# EAGLE design Konwerter USB RS485 (EAGLE 5.09)
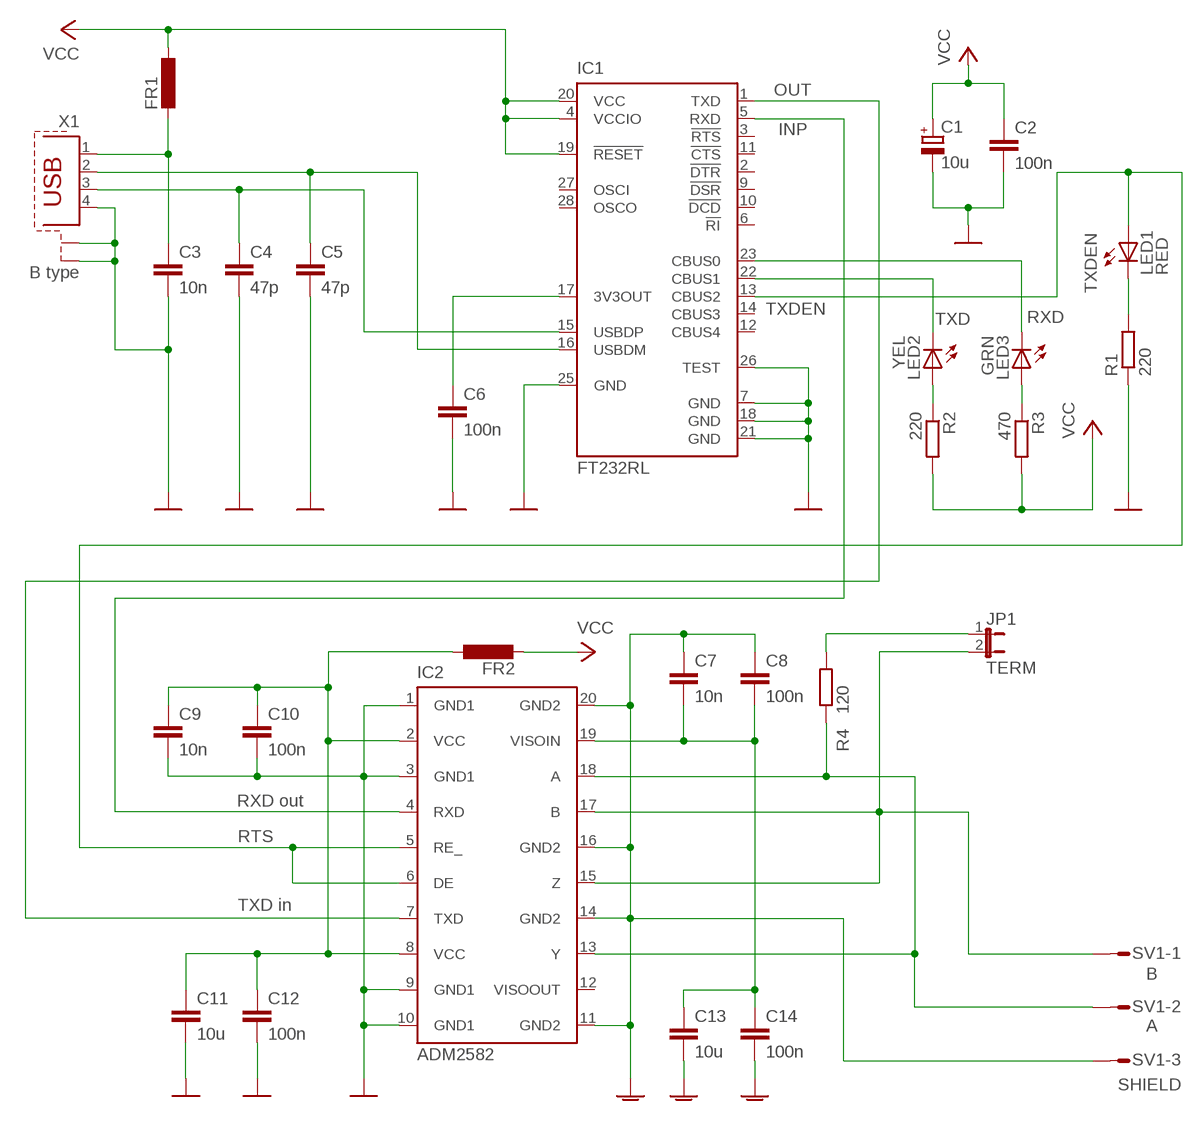
[diagram p0: schematic, sheet 1]

## Parts
C1  10u  CPOL-EUSMCB  [SMC_B]
C2  100n  C-EUC0805  [C0805]
C3  10n  C-EUC0805  [C0805]
C4  47p  C-EUC0805  [C0805]
C5  47p  C-EUC0805  [C0805]
C6  100n  C-EUC0805  [C0805]
C7  10n  C-EUC0805  [C0805]
C8  100n  C-EUC0805  [C0805]
C9  10n  C-EUC0805  [C0805]
C10  100n  C-EUC0805  [C0805]
C11  10u  C-EUC0805  [C0805]
C12  100n  C-EUC0805  [C0805]
C13  10u  C-EUC0805  [C0805]
C14  100n  C-EUC0805  [C0805]
FR1  BLM31A601SPT  L-EUL3230M  [L3230M]
FR2  L-EUL3230M  [L3230M]
IC1  FT232RL  [SSOP28]
IC2  ADM2582  [SO20W]
JP1  TERM  JP1E  [JP1]
LED1  RED  LED3MM  [LED3MM]
LED2  YEL  LED3MM  [LED3MM]
LED3  GRN  LED3MM  [LED3MM]
R1  220  R-EU_M0805  [M0805]
R2  220  R-EU_M0805  [M0805]
R3  470  R-EU_M0805  [M0805]
R4  120  R-EU_R1206  [R1206]
SV1  S03P  [S03P]
X1  B type  PN61729-S  [PN61729-S]

## Nets
GND: C1.- C2.2 C3.2 C4.2 C5.2 C6.2 C9.2 C10.2 C11.2 C12.2 IC1.7(GND) IC1.18(GND) IC1.21(GND) IC1.25(GND) IC1.26(TEST) IC2.1(GND1) IC2.3(GND1) IC2.9(GND1) IC2.10(GND1) R1.1 X1.4 X1.S1 X1.S2
GNDA: C7.1 C8.1 C13.2 C14.2 IC2.11(GND2) IC2.14(GND2) IC2.16(GND2) IC2.20(GND2) SV1.3
N$1: IC1.1(TXD) IC2.7(TXD)
N$2: IC2.13(Y) IC2.18(A) R4.1 SV1.2
N$5: IC1.23(CBUS0) LED3.K(C)
N$6: C9.1 C10.1 C11.1 C12.1 FR2.1 IC2.2(VCC) IC2.8(VCC)
N$8: C7.2 C8.2 C13.1 C14.1 IC2.19(VISOIN)
N$10: JP1.1 R4.2
N$13: IC2.15(Z) IC2.17(B) JP1.2 SV1.1
N$17: IC1.22(CBUS1) LED2.K(C)
N$18: LED2.A R2.1
N$20: LED3.A R3.1
N$21: C5.1 IC1.16(USBDM) X1.2
N$22: C4.1 IC1.15(USBDP) X1.3
N$23: C3.1 FR1.2 X1.1
N$25: C6.1 IC1.17(3V3OUT)
N$30: IC1.5(RXD) IC2.4(RXD)
N$31: IC1.13(CBUS2) IC2.5(RE_) IC2.6(DE) LED1.A
N$34: LED1.K(C) R1.2
VCC: C1.+ C2.1 FR1.1 FR2.2 IC1.4(VCCIO) IC1.19(!RESET) IC1.20(VCC) R2.2 R3.2
Unconnected: IC1.2(!DTR) IC1.3(!RTS) IC1.6(!RI) IC1.9(!DSR) IC1.10(!DCD) IC1.11(!CTS) IC1.12(CBUS4) IC1.14(CBUS3) IC1.27(OSCI) IC1.28(OSCO) IC2.12(VISOOUT)

## Notes on the sheet
- OUT
- INP
- TXDEN
- TXDEN
- TXD | RXD
- RXD out
- RTS
- TXD in
- B
- A
- SHIELD

## Library data of the parts
C1 = rcl:CPOL-EU: POLARIZED CAPACITOR, European symbol
C2-C14 = rcl:C-EU: CAPACITOR, European symbol
FR1 FR2 = rcl:L-EU: INDUCTOR, European symbol
IC1 = ftdichip:FT232R: Source: http://www.ftdichip.com/Documents/DataSheets/DS_FT232R_v104.pdf
IC2 = analog-devices:ADM2582: Signal and Power Isolated RS-485 Transceiver with ±15 kV ESD Protection
JP1 = jumper:JP1E: JUMPER
LED1-LED3 = led:LED: LED OSRAM: - CHIPLED LG R971, LG N971, LY N971, LG Q971, LY Q971, LO R971, LY R971 LH N974, LH R974 LS Q976, LO Q976, LY Q976 LO Q996 - Hyper CHIPLED LW Q18S LB Q993, LB Q99A, LB R99A - SideLED LS A670, LO A670, LY A670, LG A670, LP A670 LB A673, LV A673, LT A673, LW A673 LH A674 LY A675 LS A676, LA A676, LO A676, LY A676, LW A676 LS A679, LY A679, LG A679 - Hyper Micro SIDELED® LS Y876, LA Y876, LO Y876, LY Y876 LT Y87S - SmartLED LW L88C, LW L88S LB L89C, LB L89S, LG L890 LS L89K, LO L89K, LY L89K LS L896, LA L896, LO L896, LY L896 - TOPLED LS T670, LO T670, LY T670, LG T670, LP T670 LSG T670, LSP T670, LSY T670, LOP T670, LYG T670 LG T671, LOG T671, LSG T671 LB T673, LV T673, LT T673, LW T673 LH T674 LS T676, LA T676, LO T676, LY T676, LB T676, LH T676, LSB T676, LW T676 LB T67C, LV T67C, LT T67C, LS T67K, LO T67K, LY T67K, LW E67C LS E67B, LA E67B, LO E67B, LY E67B, LB E67C, LV E67C, LT E67C LW T67C LS T679, LY T679, LG T679 LS T770, LO T770, LY T770, LG T770, LP T770 LB T773, LV T773, LT T773, LW T773 LH T774 LS E675, LA E675, LY E675, LS T675 LS T776, LA T776, LO T776, LY T776, LB T776 LHGB T686 LT T68C, LB T68C - Hyper Mini TOPLED® LB M676 - Mini TOPLED Santana® LG M470 LS M47K, LO M47K, LY M47K Source: http://www.osram.convergy.de - LUMILED® LXK2-PW12-R00, LXK2-PW12-S00, LXK2-PW14-U00, LXK2-PW14-V00 LXK2-PM12-R00, LXK2-PM12-S00, LXK2-PM14-U00 LXK2-PE12-Q00, LXK2-PE12-R00, LXK2-PE12-S00, LXK2-PE14-T00, LXK2-PE14-U00 LXK2-PB12-K00, LXK2-PB12-L00, LXK2-PB12-M00, LXK2-PB14-N00, LXK2-PB14-P00, LXK2-PB14-Q00 LXK2-PR12-L00, LXK2-PR12-M00, LXK2-PR14-Q00, LXK2-PR14-R00 LXK2-PD12-Q00, LXK2-PD12-R00, LXK2-PD12-S00 LXK2-PH12-R00, LXK2-PH12-S00 LXK2-PL12-P00, LXK2-PL12-Q00, LXK2-PL12-R00 Source: www.luxeon.com
R1-R4 = rcl:R-EU_: RESISTOR, European symbol
SV1 = con-amp-mt:S03P: AMP MT CONNECTOR
X1 = con-berg:PN61729-S: BERG USB connector

## Board
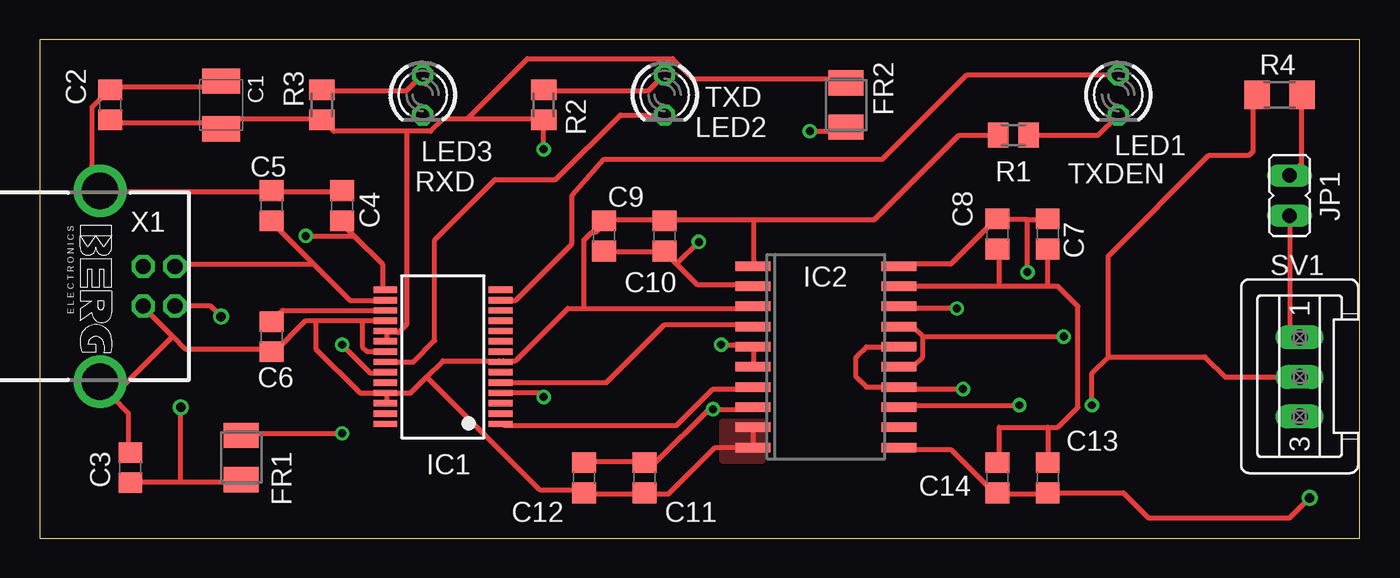
[diagram p1: board, top side]
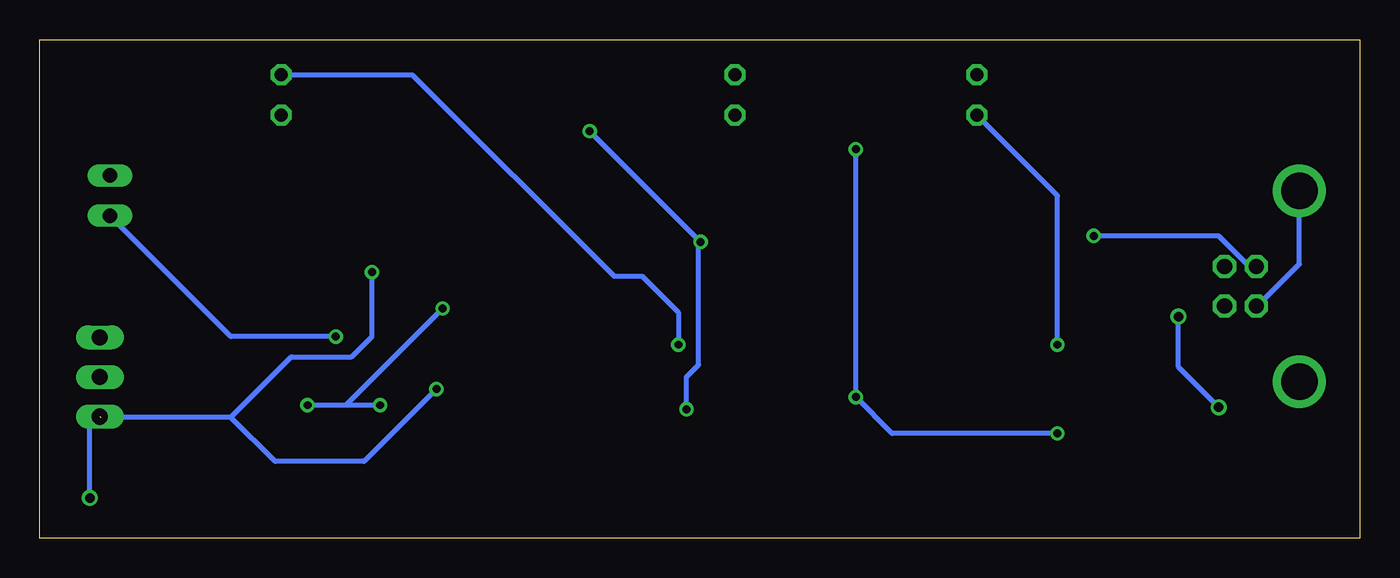
[diagram p2: board, bottom side, seen from below]

Size 83.17 x 31.42 mm. Coordinates in mm from the lower left corner, seen from the top.
Outline: 0,0 83.17,0 83.17,31.42 0,31.42 0,0
Copper layers (1*16): Top 0.035mm / dielectric 1.5mm / Bottom 0.035mm
Design rules "cntr": minimum track width 12mil, minimum drill 0.5mm, track to track 11mil, track to pad 8mil, pad to pad 8mil, via to via 12mil, smd to smd 8mil, copper to edge 40mil, drill to drill 8mil, minimum pad ring 10mil, minimum via ring 8mil, stop-mask expansion 4mil, vias tented up to drill 0mil, thermal gap 10mil

### Footprints (pad centres in the part's own frame; a part is rotated, then mirrored left to right if it is on the bottom)
SMC_B = smd 1.6 x 2.4: + -1.5,0; - 1.5,0
C0805 = smd 1.3 x 1.5: 1 -0.95,0; 2 0.95,0
L3230M = smd 1.6 x 2.2: 1 -1.4,0; 2 1.4,0
SSOP28 = smd 0.4 x 1.5: 1 -4.225,-3.625; 2 -3.575,-3.625; 3 -2.925,-3.625; 4 -2.275,-3.625; 5 -1.625,-3.625; 6 -0.975,-3.625; 7 -0.325,-3.625; 8 0.325,-3.625; 9 0.975,-3.625; 10 1.625,-3.625; 11 2.275,-3.625; 12 2.925,-3.625; 13 3.575,-3.625; 14 4.225,-3.625; 15 4.225,3.625; 16 3.575,3.625; 17 2.925,3.625; 18 2.275,3.625; 19 1.625,3.625; 20 0.975,3.625; 21 0.325,3.625; 22 -0.325,3.625; 23 -0.975,3.625; 24 -1.625,3.625; 25 -2.275,3.625; 26 -2.925,3.625; 27 -3.575,3.625; 28 -4.225,3.625
SO20W = smd 0.6 x 2.2: 1 -5.715,-4.6; 2 -4.445,-4.6; 3 -3.175,-4.6; 4 -1.905,-4.6; 5 -0.635,-4.6; 6 0.635,-4.6; 7 1.905,-4.6; 8 3.175,-4.6; 9 4.445,-4.6; 10 5.715,-4.6; 11 5.715,4.6; 12 4.445,4.6; 13 3.175,4.6; 14 1.905,4.6; 15 0.635,4.6; 16 -0.635,4.6; 17 -1.905,4.6; 18 -3.175,4.6; 19 -4.445,4.6; 20 -5.715,4.6
JP1 = drill 0.914 long: 1 0,-1.27; 2 0,1.27
LED3MM = drill 0.813 octagon: A -1.27,0; K 1.27,0
M0805 = smd 1.3 x 1.6: 1 -0.95,0; 2 0.95,0
R1206 = smd 1.6 x 1.803: 1 -1.422,0; 2 1.422,0
S03P = drill 1.016 long: 1 2.5,0; 2 0,0; 3 -2.5,0
PN61729-S = drill 0.95 octagon: 1 1.25,4.71; 2 -1.25,4.71; 3 -1.25,2.71; 4 1.25,2.71 | drill 2.3 pad 2.9 round: S1 -6.02,0; S2 6.02,0

### Placement (x,y rotation side)
C1  11.43,27.3 90 top
C2  4.45,27.3 90 top
C3  5.71,4.45 90 top
C4  19.05,20.95 90 top
C5  14.61,20.95 90 top
C6  14.61,12.7 270 top
C7  63.5,19.18 270 top
C8  60.33,19.18 270 top
C9  35.56,19.05 90 top
C10  39.37,19.05 90 top
C11  38.1,3.81 270 top
C12  34.29,3.81 270 top
C13  63.5,3.81 270 top
C14  60.33,3.81 270 top
FR1  12.7,5.08 270 top
FR2  50.8,27.3 90 top
IC1  25.4,11.43 90 top
IC2  49.53,11.43 270 top
JP1  78.74,21.59 180 top
LED1  67.94,27.94 270 top
LED2  39.37,27.94 270 top
LED3  24.13,27.94 270 top
R1  61.34,25.4 0 top
R2  31.75,27.3 270 top
R3  17.78,27.3 270 top
R4  78.11,27.94 0 top
SV1  79.38,10.16 90 top
X1  3.81,15.88 270 top

### Tracks (layer width: path | path; a pad name or v marks a point on that pad's centre or on a via)
GND
  Top 0.305: C1.- 11.43,28.7 11.18,28.45 4.57,28.45 C2.2 4.32,28.19 3.3,27.18 3.3,22.61 3.81,22.1 X1.S1 3.81,21.84 14.48,21.84 C5.2 14.73,21.84 19.05,21.84 C4.2 | 4.57,8.89 3.81,9.65 X1.S2 4.57,8.89 | 4.57,8.89 5.59,7.87 5.59,5.59 C3.2 | 8.38,12.7 6.6,14.48 X1.4 | 8.38,12.7 9.14,11.94 14.48,11.94 C6.2 14.73,11.68 16.76,13.72 17.4,13.72 | 17.4,13.72 20.32,13.72 | 20.32,13.72 21.59,13.72 IC1.18 | 4.57,8.89 8.38,12.7 | 39.37,20.07 44.96,20.07 | 39.37,20.07 35.56,20.07 C9.2 35.56,19.81 35.05,19.3 34.8,19.3 34.29,18.8 34.29,14.48 | 39.37,20.07 C10.2 | 44.96,20.07 44.96,17.27 IC2.1 | IC2.10 44.96,5.84 44.96,6.86 IC2.9 | 38.1,2.79 34.29,2.79 C12.2 34.29,3.05 31.5,3.05 24.38,10.16 | IC2.10 44.7,5.59 | 38.1,2.79 C11.2 | 21.84,9.14 21.84,8.64 IC1.26 | 24.38,10.16 23.37,9.14 21.84,9.14 | 24.38,10.16 25.4,11.18 28.96,11.18 IC1.7 29.21,11.18 29.97,11.18 33.27,14.48 34.29,14.48 | 21.84,9.14 IC1.25 21.59,9.14 20.19,9.14 17.4,11.94 17.4,13.72 | 34.29,14.48 44.7,14.48 IC2.3 | IC1.21 20.63,11.76 20.32,12.06 20.32,13.72 | 38.1,2.79 39.62,2.79 42.55,5.71 IC2.10 | 44.96,20.07 52.58,20.07 57.91,25.4 R1.1
  Bottom 0.305: X1.S1 3.81,17.27 6.35,14.73 X1.4
  pour Top (no thermals): 43,7.39 45.54,7.39 45.54,4.85 43,4.85
GNDA  (via drill 0.5, 0.6)  (1 unrouted)
  Top 0.305: 62.23,20.07 63.5,20.07 C7.1 | 62.23,20.07 60.45,20.07 C8.1 60.2,20.07 57.4,17.27 54.36,17.27 IC2.20 | IC2.11 54.36,5.59 57.4,5.59 60.2,2.79 60.45,2.79 | v58.17,9.4 54.36,9.4 IC2.14 52.07,9.53 51.44,10.16 51.44,11.43 52.07,12.06 IC2.16 | v62.23,16.76 62.23,20.07 | v80.01,2.54 78.74,1.27 69.85,1.27 68.26,2.86 C13.2 63.43,2.79 60.45,2.79 | 60.45,2.79 C14.2
  Bottom 0.305: v58.17,9.4 62.74,4.83 68.33,4.83 71.12,7.62 | v62.23,16.76 62.23,12.7 63.5,11.43 67.31,11.43 71.12,7.62 | 71.12,7.62 79.33,7.62 | v80.01,2.54 80.01,7.03 SV1.3
N$1
  Top 0.305: IC1.1 29.21,7.11 40.13,7.11 42.42,9.4 44.7,9.4 IC2.7
N$2  (via drill 0.5)
  Top 0.305: R4.1 76.45,27.94 76.45,24.38 76.2,24.13 73.66,24.13 67.31,17.78 67.31,11.43 | v61.72,8.38 54.36,8.38 IC2.13 | v57.78,14.48 54.36,14.48 IC2.18 | v66.29,8.38 66.29,10.41 67.31,11.43 | 67.31,11.43 73.41,11.43 74.68,10.16 SV1.2
  Bottom 0.305: 63.88,8.38 v66.29,8.38 | v61.72,8.38 63.88,8.38 | 63.88,8.38 v57.78,14.48
N$5  (via drill 0.5)
  Top 0.305: v19.05,12.19 20.83,10.41 21.59,10.41 IC1.23
  Bottom 0.305: v19.05,12.19 19.05,21.59 LED3.K
N$6  (via drill 0.5)
  Top 0.305: 38.1,4.83 34.29,4.83 C12.1 | 38.1,4.83 38.86,4.83 42.16,8.13 v42.42,8.13 44.7,8.13 IC2.8 | 38.1,4.83 C11.1 | 39.37,18.03 35.56,18.03 C9.1 | 40.13,17.27 39.37,18.03 | 40.13,17.27 41.4,16 44.7,16 IC2.2 | 39.37,18.03 C10.1 | v48.51,25.65 50.8,25.65 FR2.1 | v41.53,18.67 40.13,17.27
  Bottom 0.305: v48.51,25.65 v41.53,18.67 41.66,18.54 41.66,10.92 42.42,10.16 v42.42,8.13
N$8
  Top 0.305: 63.5,15.88 64.14,15.88 65.41,14.61 65.41,8.26 64.14,6.99 63.5,6.99 | 63.5,15.88 60.45,15.88 | 60.45,15.88 IC2.19 | 63.5,6.99 60.45,6.99 60.45,4.83 C14.1 | C8.2 60.45,18.03 60.45,15.88 | 63.5,15.88 C7.2 | 63.5,6.99 C13.1
N$10
  Top 0.305: JP1.1 79.5,23.62 79.5,27.94 R4.2
N$13  (via drill 0.5)
  Top 0.305: 55.63,12.7 55.63,11.43 55.12,10.92 54.36,10.92 IC2.15 | 55.63,12.7 55.12,13.21 54.36,13.21 IC2.17 | 55.63,12.7 v64.52,12.7 | JP1.2 78.74,13.29 SV1.1
  Bottom 0.305: v64.52,12.7 71.12,12.7 JP1.2
N$17
  Top 0.305: IC1.22 23.55,11.11 24.89,12.45 24.89,18.8 28.7,22.61 32.51,22.61 36.58,26.67 LED2.K
N$18
  Top 0.305: LED2.A 38.35,28.19 31.75,28.19 R2.1
N$20
  Top 0.305: LED3.A 23.11,28.19 17.78,28.19 R3.1
N$21
  Top 0.305: 17.27,17.27 14.73,19.81 C5.1 | 17.27,17.27 19.56,14.99 21.59,14.99 IC1.16 | 17.27,17.27 8.64,17.27 X1.2
N$22  (via drill 0.5)
  Top 0.305: 19.81,19.05 19.05,19.81 C4.1 | 19.81,19.05 21.59,17.27 21.59,15.75 IC1.15 | v16.76,19.05 19.81,19.05
  Bottom 0.305: v16.76,19.05 8.89,19.05 7.11,17.27 6.6,17.27 X1.3
N$23  (via drill 0.6)
  Top 0.305: 8.89,3.56 5.84,3.56 C3.1 5.59,3.56 | 8.89,3.56 12.7,3.56 FR1.2 | X1.1 10.78,14.62 v11.43,13.97 | 8.89,3.56 v8.89,8.26
  Bottom 0.305: v11.43,13.97 11.43,10.79 v8.89,8.26
N$25
  Top 0.305: IC1.17 15.31,14.36 C6.1
N$30
  Top 0.305: IC1.5 35.71,9.8 39.37,13.46 44.8,13.46 IC2.4
N$31  (via drill 0.5)
  Top 0.305: IC2.6 44.96,10.92 44.96,11.94 IC2.5 44.7,12.19 v42.93,12.19 | IC1.13 29.21,14.99 29.97,14.99 33.53,18.54 33.53,21.59 35.56,23.88 53.09,23.88 58.42,29.21 LED1.A
  Bottom 0.305: LED1.A 59.69,29.21 46.99,16.51 45.21,16.51 42.93,14.22 v42.93,12.19
N$34
  Top 0.305: R1.2 66.67,25.4 LED1.K
VCC  (via drill 0.5)
  Top 0.305: 21.84,12.95 21.84,12.45 IC1.20 | 17.78,26.42 11.94,26.42 11.68,26.16 | 11.68,26.16 11.43,25.91 C1.+ 11.68,26.16 | 26.92,26.42 25.4,26.42 24.64,25.65 23.11,25.65 | 26.92,26.42 31.75,26.42 R2.2 v31.75,24.51 | 23.11,25.65 18.54,25.65 17.78,26.42 | 17.78,26.42 R3.2 | 11.68,26.16 4.57,26.16 C2.1 | v31.75,8.89 31.5,9.14 29.21,9.14 IC1.4 | 21.84,12.95 22.61,12.95 23.11,13.46 23.11,25.65 | 21.84,12.95 IC1.19 | v19.05,6.6 12.7,6.6 FR1.1 | 26.92,26.42 30.73,30.23 39.88,30.23 41.15,28.96 50.8,28.96 FR2.2
  Bottom 0.305: v31.75,24.51 v31.75,8.89 29.46,6.6 v19.05,6.6

### Text on the board
tNames: TXD | RXD | TXDEN